# EAGLE design V6 (EAGLE 9.5.1)
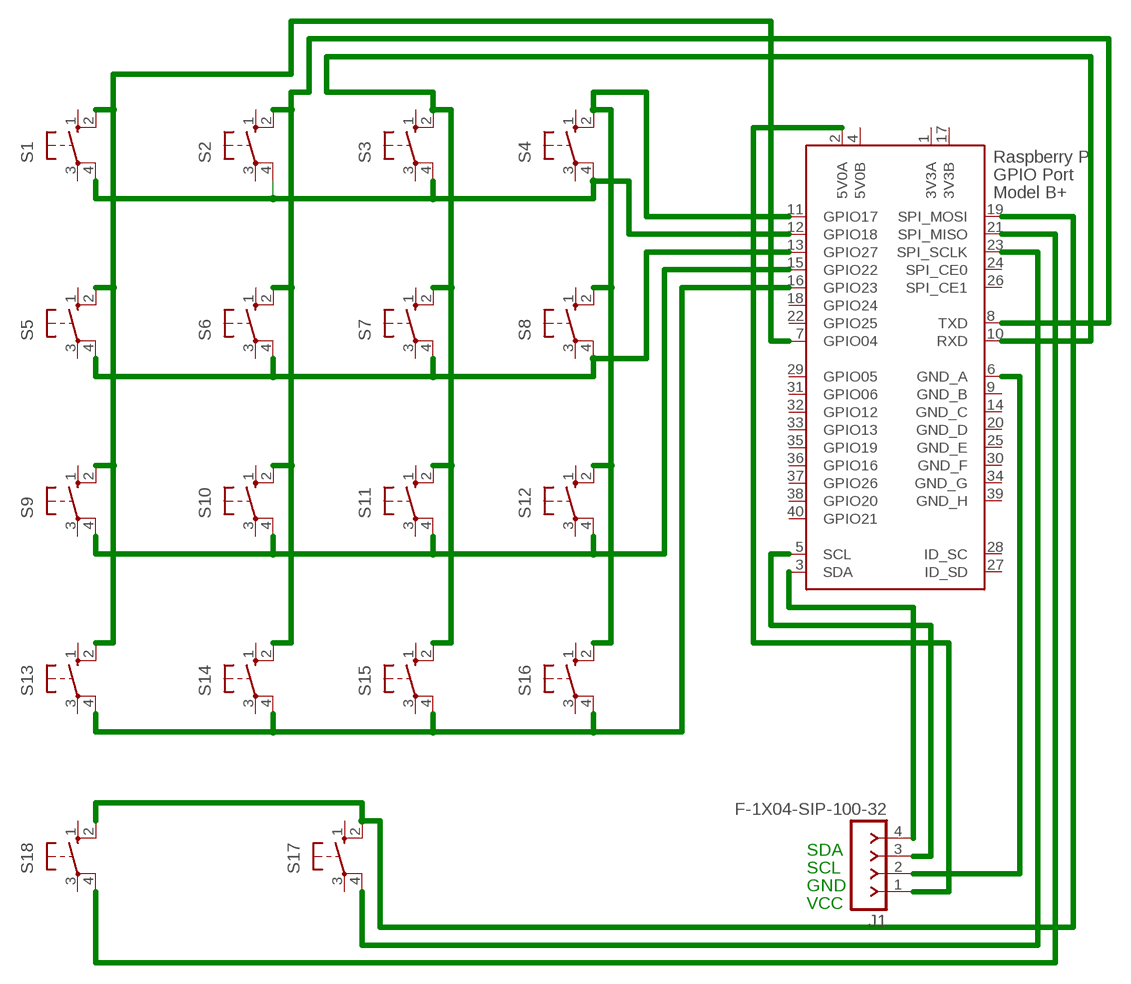
[diagram p0: schematic, sheet 1]

## Parts
J1  F-1X04-SIP-100-32  [SIP-100-04-32]
S1  40-XX  [B3F-40XX]
S2  40-XX  [B3F-40XX]
S3  40-XX  [B3F-40XX]
S4  40-XX  [B3F-40XX]
S5  40-XX  [B3F-40XX]
S6  40-XX  [B3F-40XX]
S7  40-XX  [B3F-40XX]
S8  40-XX  [B3F-40XX]
S9  40-XX  [B3F-40XX]
S10  40-XX  [B3F-40XX]
S11  40-XX  [B3F-40XX]
S12  40-XX  [B3F-40XX]
S13  40-XX  [B3F-40XX]
S14  40-XX  [B3F-40XX]
S15  40-XX  [B3F-40XX]
S16  40-XX  [B3F-40XX]
S17  40-XX  [B3F-40XX]
S18  40-XX  [B3F-40XX]
X1  RASPI_GPIO_B+#_PIN  [RASPI_GPIO_B+_PIN]

## Nets
N$1: S1.2(S1) S5.2(S1) S9.2(S1) S13.2(S1) X1.7(GPIO04)
N$2: S2.2(S1) S6.2(S1) S10.2(S1) S14.2(S1) X1.8(TXD)
N$3: J1.1 X1.2(5V0A)
N$4: J1.4 X1.3(SDA)
N$5: S13.4(P1) S14.4(P1) S15.4(P1) S16.4(P1) X1.16(GPIO23)
N$6: S9.4(P1) S10.4(P1) S11.4(P1) S12.4(P1) X1.15(GPIO22)
N$7: S5.4(P1) S6.4(P1) S7.4(P1) S8.4(P1) X1.13(GPIO27)
N$8: S1.4(P1) S2.4(P1) S3.4(P1) S4.4(P1) X1.12(GPIO18)
N$9: S3.2(S1) S7.2(S1) S11.2(S1) S15.2(S1) X1.10(RXD)
N$10: S18.4(P1) X1.21(SPI_MISO)
N$11: S17.4(P1) X1.23(SPI_SCLK)
N$12: J1.3 X1.5(SCL)
N$14: J1.2 X1.6(GND_A)
N$15: S17.2(S1) S18.2(S1) X1.19(SPI_MOSI)
N$19: S4.2(S1) S8.2(S1) S12.2(S1) S16.2(S1) X1.11(GPIO17)
Unconnected: S1.1(S) S1.3(P) S2.1(S) S2.3(P) S3.1(S) S3.3(P) S4.1(S) S4.3(P) S5.1(S) S5.3(P) S6.1(S) S6.3(P) S7.1(S) S7.3(P) S8.1(S) S8.3(P) S9.1(S) S9.3(P) S10.1(S) S10.3(P) S11.1(S) S11.3(P) S12.1(S) S12.3(P) S13.1(S) S13.3(P) S14.1(S) S14.3(P) S15.1(S) S15.3(P) S16.1(S) S16.3(P) S17.1(S) S17.3(P) S18.1(S) S18.3(P) X1.18(GPIO24) X1.22(GPIO25) X1.24(SPI_CE0) X1.26(SPI_CE1) X1.27(ID_SD) X1.28(ID_SC) X1.29(GPIO05) X1.31(GPIO06) X1.32(GPIO12) X1.33(GPIO13) X1.35(GPIO19) X1.36(GPIO16) X1.37(GPIO26) X1.38(GPIO20) X1.40(GPIO21)

## Notes on the sheet
- SDA
- SCL
- GND
- VCC

## Power pins joined to a net without a drawn wire
3V3A: X1.1(3V3A)
3V3B: X1.17(3V3B)
5V0B: X1.4(5V0B)
GND_B: X1.9(GND_B)
GND_C: X1.14(GND_C)
GND_D: X1.20(GND_D)
GND_E: X1.25(GND_E)
GND_F: X1.30(GND_F)
GND_G: X1.34(GND_G)
GND_H: X1.39(GND_H)

## Library data of the parts
J1 = con-headers-jp:F-1X04-: FEMALE HEADER
S1-S18 = switch-omron:40-XX: OMRON SWITCH; MF: OMRON COMPONENTS USA; MPN: B3F-4000; OC_FARNELL: 176434; OC_NEWARK: 36K3105
X1 = raspberrypi_bastelstube_v13:RASPI_GPIO_B+#: 2x20 header connector, all pins connected

## Net classes
0 default: width 0.508 mm, clearance 0.33 mm

## Board
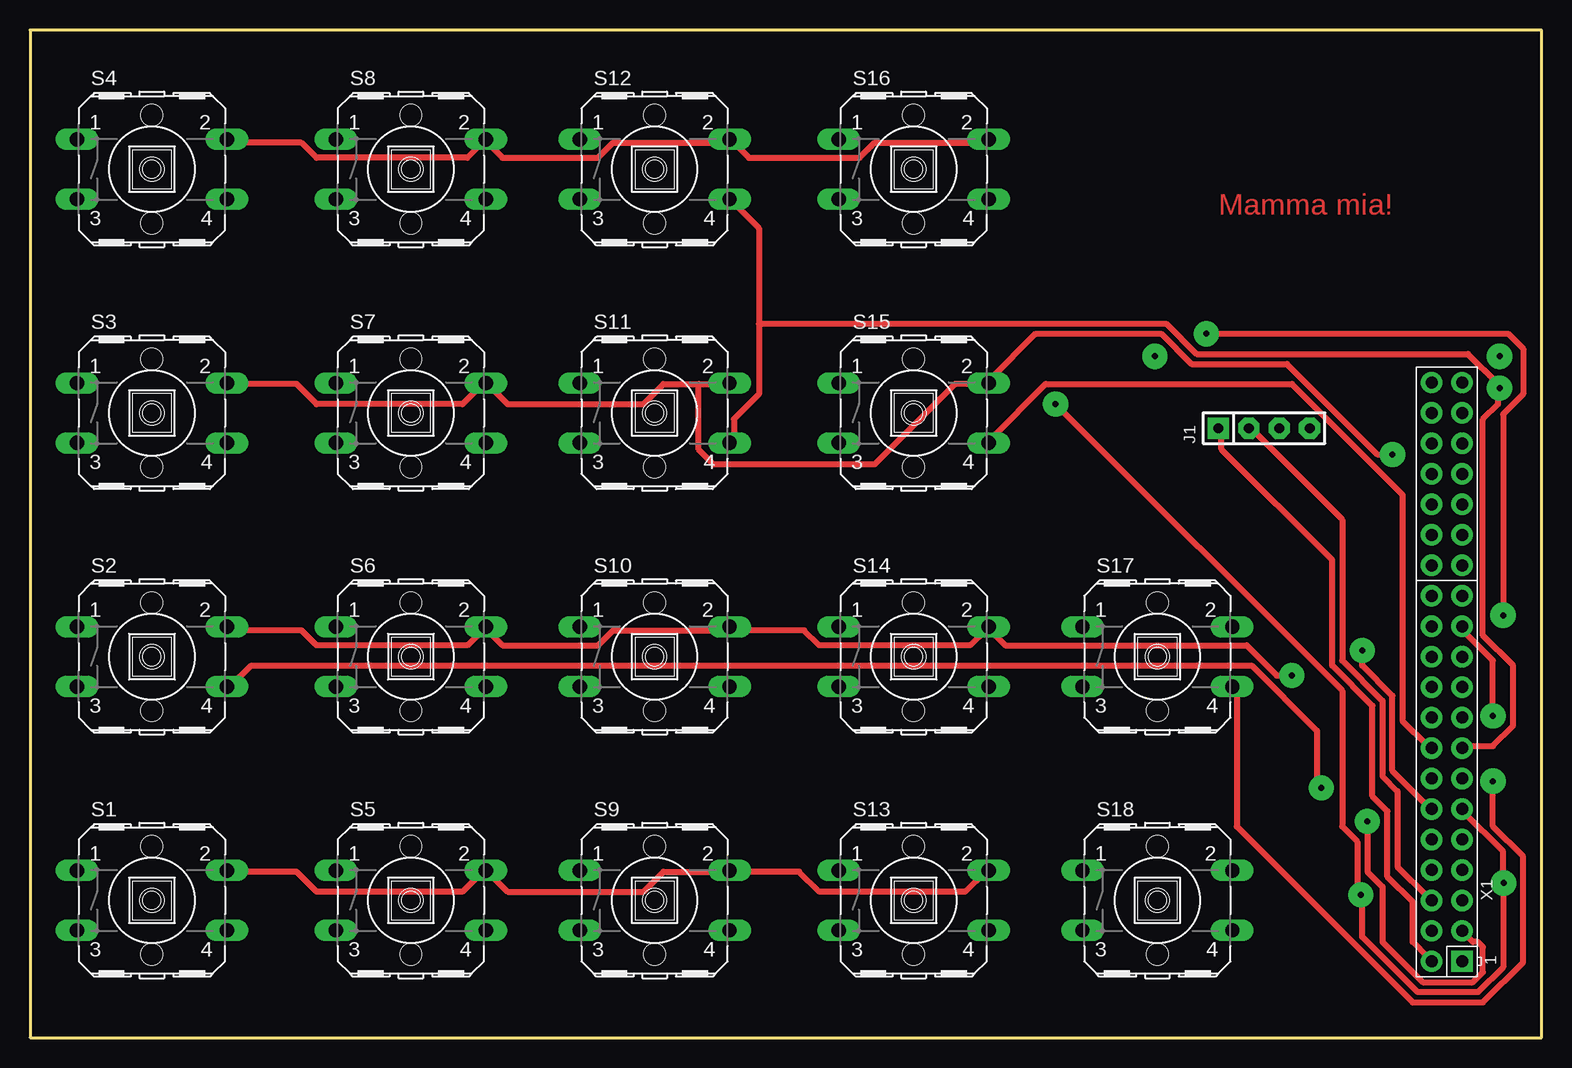
[diagram p1: board, top side]
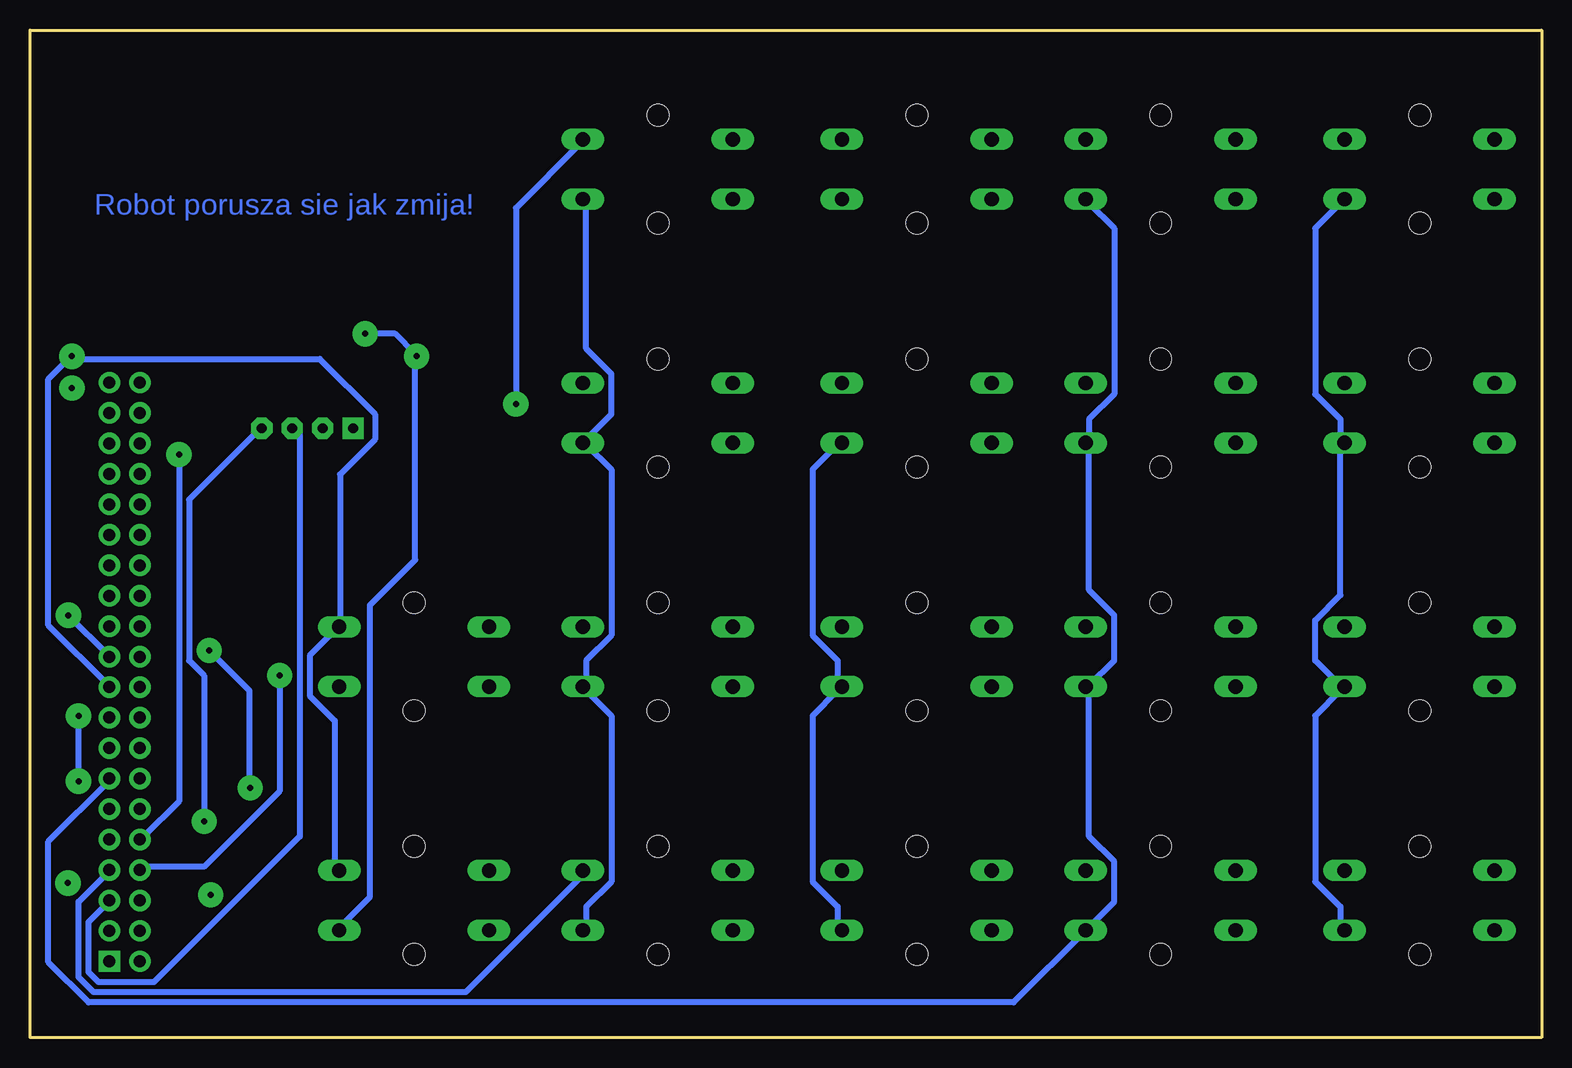
[diagram p2: board, bottom side, seen from below]

Size 126 x 84 mm. Coordinates in mm from the lower left corner, seen from the top.
Outline: 0,84 0,0 126,0 126,84 0,84
Copper layers (1*16): Top 0.035mm / dielectric 1.5mm / Bottom 0.035mm
Design rules "default *": minimum track width 6mil, minimum drill 0.5mm, track to track 13mil, track to pad 13mil, pad to pad 13mil, via to via 13mil, smd to smd 13mil, copper to edge 40mil, drill to drill 6mil, minimum pad ring 10mil, minimum via ring 0.8mm, stop-mask expansion 4mil, vias tented up to drill 0mil, thermal gap 10mil

### Footprints (pad centres in the part's own frame; a part is rotated, then mirrored left to right if it is on the bottom)
SIP-100-04-32 = drill 0.813 pad 1.778 square: 1 -3.81,0 | drill 0.813 pad 1.778 octagon: 2 -1.27,0; 3 1.27,0; 4 3.81,0
B3F-40XX = drill 1.194 long: 1 -6.248,2.489; 2 6.248,2.489; 3 -6.248,-2.489; 4 6.248,-2.489 | hole 1.803: 0,-4.496; 0,4.496
RASPI_GPIO_B+_PIN = drill 1 pad 1.778 square: 1 -24.13,-1.27 | drill 1 pad 1.778: 2 -24.13,1.27; 3 -21.59,-1.27; 4 -21.59,1.27; 5 -19.05,-1.27; 6 -19.05,1.27; 7 -16.51,-1.27; 8 -16.51,1.27; 9 -13.97,-1.27; 10 -13.97,1.27; 11 -11.43,-1.27; 12 -11.43,1.27; 13 -8.89,-1.27; 14 -8.89,1.27; 15 -6.35,-1.27; 16 -6.35,1.27; 17 -3.81,-1.27; 18 -3.81,1.27; 19 -1.27,-1.27; 20 -1.27,1.27; 21 1.27,-1.27; 22 1.27,1.27; 23 3.81,-1.27; 24 3.81,1.27; 25 6.35,-1.27; 26 6.35,1.27; 27 8.89,-1.27; 28 8.89,1.27; 29 11.43,-1.27; 30 11.43,1.27; 31 13.97,-1.27; 32 13.97,1.27; 33 16.51,-1.27; 34 16.51,1.27; 35 19.05,-1.27; 36 19.05,1.27; 37 21.59,-1.27; 38 21.59,1.27; 39 24.13,-1.27; 40 24.13,1.27

### Placement (x,y rotation side)
J1  102.87,50.8 0 top
S1  10.16,11.43 0 top
S2  10.16,31.75 0 top
S3  10.16,52.07 0 top
S4  10.16,72.39 0 top
S5  31.75,11.43 0 top
S6  31.75,31.75 0 top
S7  31.75,52.07 0 top
S8  31.75,72.39 0 top
S9  52.07,11.43 0 top
S10  52.07,31.75 0 top
S11  52.07,52.07 0 top
S12  52.07,72.39 0 top
S13  73.66,11.43 0 top
S14  73.66,31.75 0 top
S15  73.66,52.07 0 top
S16  73.66,72.39 0 top
S17  93.98,31.75 0 top
S18  93.98,11.43 0 top
X1  118.11,30.48 90 top

### Tracks (layer width: path | path; a pad name or v marks a point on that pad's centre or on a via)
N$1
  Top 0.508: S1.2 16.76,13.83 22.21,13.83 23.89,12.15 36.04,12.15 37.72,13.83 S5.2 38.14,13.83 39.81,12.15 51.13,12.15 52.81,13.83 58.26,13.83 S9.2 58.67,13.83 64.12,13.83 65.8,12.15 77.95,12.15 79.63,13.83 S13.2
  Bottom 0.508: X1.7 119.44,13.83 121.96,11.32 121.96,5.03 120.7,3.77 89.69,3.77 79.63,13.83 S13.2
N$2  (via drill 0.5)
  Top 0.508: S2.2 16.76,33.95 22.63,33.95 23.89,32.69 36.46,32.69 37.72,33.95 S6.2 38.14,33.95 39.4,32.69 47.36,32.69 48.62,33.95 58.26,33.95 S10.2 58.67,33.95 64.54,33.95 65.8,32.69 78.37,32.69 79.63,33.95 S14.2 80.05,33.95 81.31,32.69 101.42,32.69 103.94,30.18 v105.19,30.18
  Bottom 0.508: v105.19,30.18 105.19,20.54 111.48,14.25 116.51,14.25 X1.8
N$3
  Top 0.508: J1.1 99.33,50.71 99.33,49.03 108.55,39.81 108.55,31.01 111.9,27.66 111.9,20.12 113.16,18.86 113.16,13.41 115.25,11.32 115.25,7.96 116.51,6.71 X1.2
N$4  (via drill 0.5)
  Top 0.508: v111.48,18.02 111.48,13.83 112.74,12.57 112.74,7.96 116.09,4.61 120.28,4.61 121.12,5.45 121.12,7.54 120.7,7.96 120.28,7.96 119.44,8.8 X1.3
  Bottom 0.508: v111.48,18.02 111.48,30.18 112.74,31.43 112.74,44.84 106.87,50.71 J1.4
N$5
  Top 0.508: X1.16 116.51,24.31 114.41,26.4 114.41,45.26 105.19,54.48 84.66,54.48 80.05,49.87 S15.4
  Bottom 0.508: S13.4 79.63,9.22 79.63,10.9 77.53,12.99 77.53,26.82 79.63,28.92 S14.4 79.63,29.34 79.63,31.43 77.53,33.53 77.53,47.36 79.63,49.45 S15.4 79.63,49.87 77.53,51.97 77.53,55.32 79.63,57.42 79.63,69.57 S16.4
N$6  (via drill 0.5)
  Top 0.508: X1.15 119.44,24.31 121.96,24.31 123.64,25.98 123.64,31.01 121.12,33.53 121.12,51.55 122.38,52.81 122.38,54.06 v122.5,54.15 122.38,54.48 119.86,57 97.23,57 94.72,59.51 60.77,59.51 | 60.77,59.51 60.77,67.47 58.67,69.57 S12.4 | 60.77,59.51 60.77,53.65 58.67,51.55 58.67,49.87 S11.4
  Bottom 0.508: S9.4 58.67,9.22 58.67,10.9 60.77,12.99 60.77,26.82 58.67,28.92 S10.4 58.67,29.34 58.67,31.43 60.77,33.53 60.77,47.36 58.67,49.45 S11.4
N$7
  Bottom 0.508: S8.4 37.72,69.57 35.62,67.47 35.62,53.65 37.72,51.55 37.72,49.87 S7.4 37.72,49.45 37.72,37.3 35.62,35.2 35.62,31.43 37.72,29.34 S6.4 37.72,28.92 37.72,16.76 35.62,14.67 35.62,11.32 S5.4 44.01,2.93 121.12,2.93 124.47,6.29 124.47,16.34 119.44,21.37 X1.13
N$8  (via drill 0.5)
  Top 0.508: v111.06,32.27 111.06,31.01 113.58,28.5 113.58,22.21 116.51,19.28 X1.12 | v107.64,20.8 107.29,20.95 107.29,25.57 101.84,31.01 18.44,31.01 16.76,29.34 S2.4
  Bottom 0.508: S4.4 16.76,69.57 18.86,67.47 18.86,53.65 16.76,51.55 16.76,49.87 S3.4 16.76,49.45 16.76,36.88 18.86,34.78 18.86,31.43 16.76,29.34 S2.4 16.76,28.92 18.86,26.82 18.86,12.99 16.76,10.9 16.76,9.22 S1.4 | v111.06,32.27 107.71,28.92 107.71,20.95 v107.64,20.8
N$9  (via drill 0.5)
  Top 0.508: S3.2 16.76,54.48 22.21,54.48 23.89,52.81 36.04,52.81 37.72,54.48 S7.2 38.14,54.48 39.81,52.81 51.13,52.81 52.81,54.48 55.74,54.48 | 55.74,54.48 58.26,54.48 S11.2 | v113.58,48.62 112.32,48.62 104.78,56.16 96.81,56.16 94.3,58.67 83.82,58.67 80.05,54.9 S15.2 79.63,54.48 77.11,54.48 70.41,47.78 57,47.78 55.74,49.03 55.74,54.48
  Bottom 0.508: v113.58,48.62 113.58,19.7 116.51,16.76 X1.10
N$10  (via drill 0.5)
  Top 0.508: v122.8,35.2 122.8,51.97 124.47,53.65 124.47,57.42 123.22,58.67 v98.07,58.67
  Bottom 0.508: S18.4 100.17,9.22 97.65,11.73 97.65,36.04 93.88,39.81 93.88,56.58 v93.78,56.79 93.88,57 95.56,58.67 v98.07,58.67 | v122.8,35.2 119.44,31.85 X1.21
N$11  (via drill 0.5)
  Top 0.508: v121.96,26.82 121.96,31.43 119.44,33.95 X1.23 | v121.96,21.37 121.96,17.6 124.47,15.09 124.47,6.29 121.12,2.93 115.25,2.93 100.58,17.6 100.58,28.92 S17.4
  Bottom 0.508: v121.96,21.37 v121.96,26.82
N$12
  Bottom 0.508: X1.5 119.44,11.32 121.12,9.64 121.12,5.45 120.28,4.61 115.67,4.61 103.52,16.76 103.52,50.29 103.94,50.71 J1.3
N$14
  Top 0.508: X1.6 116.51,11.73 114,14.25 114,20.54 112.74,21.79 112.74,28.08 109.39,31.43 109.39,43.17 101.84,50.71 J1.2
N$15  (via drill 0.5)
  Bottom 0.508: S18.2 100.58,14.25 100.58,26.4 102.68,28.5 102.68,31.85 100.58,33.95 S17.2 100.17,34.37 100.17,46.94 97.23,49.87 97.23,51.97 101.84,56.58 122.38,56.58 v122.5,56.79 122.8,56.58 124.47,54.9 124.47,34.37 119.44,29.34 X1.19
N$19  (via drill 0.5)
  Top 0.508: X1.11 119.44,18.86 122.8,15.51 122.8,12.99 v122.83,12.88 122.8,12.57 122.8,5.87 120.7,3.77 115.67,3.77 111.06,8.38 111.06,11.73 v110.95,11.89 110.64,12.15 110.64,16.34 109.39,17.6 109.39,28.92 v85.5,52.81 | S4.2 16.76,74.6 22.63,74.6 23.89,73.34 36.46,73.34 S8.2 38.14,74.6 39.4,73.34 47.36,73.34 48.62,74.6 58.26,74.6 S12.2 58.67,74.6 59.93,73.34 69.15,73.34 70.41,74.6 79.63,74.6 S16.2
  Bottom 0.508: v85.5,52.81 85.5,69.15 80.05,74.6 S16.2

### Text on the board
Top: Mamma mia!
Bottom: Robot porusza sie jak zmija!